# EAGLE schematic damballah_motor (EAGLE 5.10)

## Sheet 1 of 7
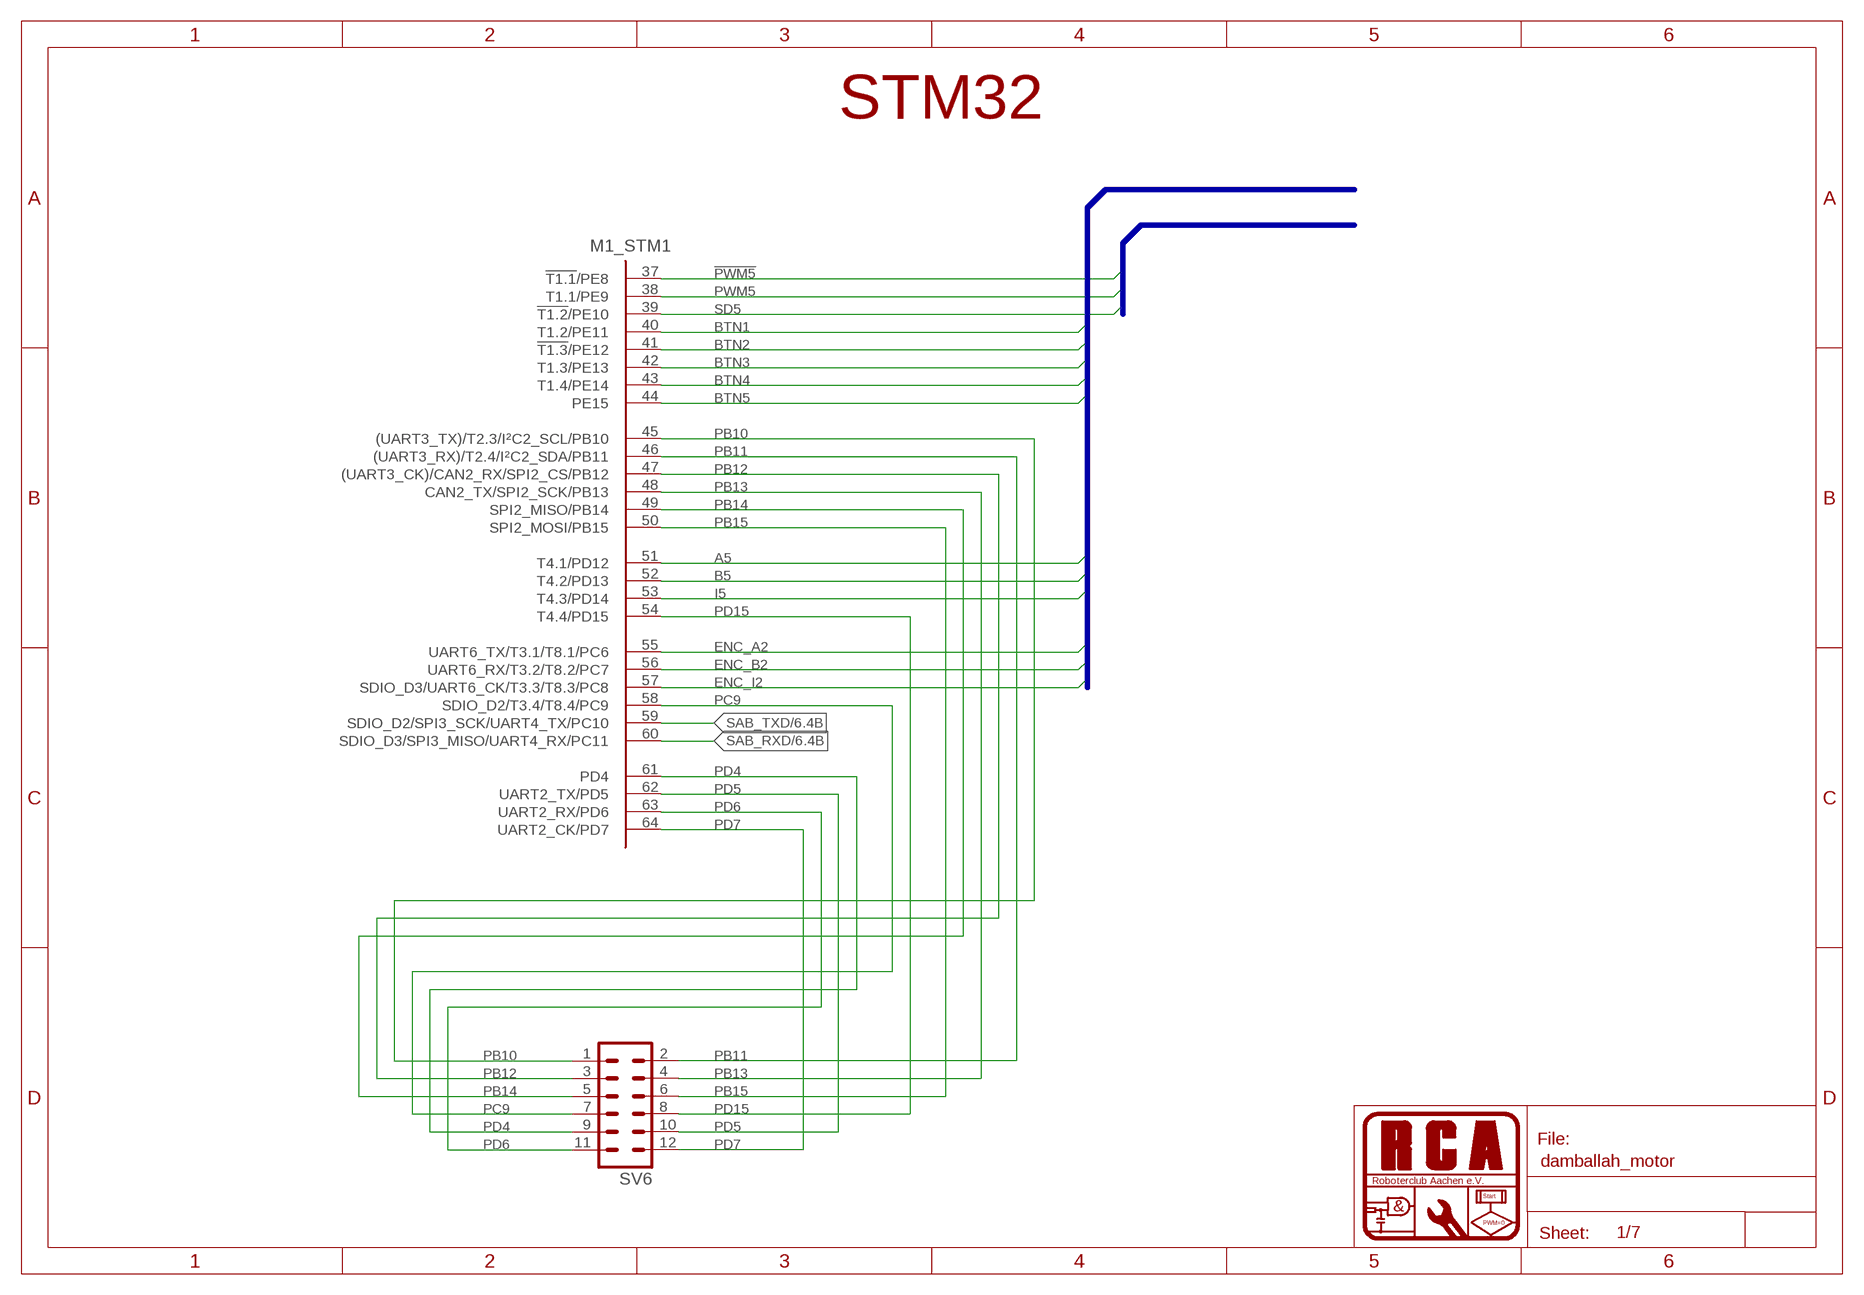
[diagram p0: schematic, sheet 1]

### Parts
M1  DAMBALLAH  [CONTROL]
SV6  MA06-2  [MA06-2]

### Nets
!PWM5: M1.37(_STM1:!T1.1!/PE8) ; also sheet 5
A5: M1.51(_STM1:T4.1/PD12) ; also sheet 5
B5: M1.52(_STM1:T4.2/PD13) ; also sheet 5
BTN1: M1.40(_STM1:T1.2/PE11) ; also sheet 6
BTN2: M1.41(_STM1:!T1.3!/PE12) ; also sheet 6
BTN3: M1.42(_STM1:T1.3/PE13) ; also sheet 6
BTN4: M1.43(_STM1:T1.4/PE14) ; also sheet 6
BTN5: M1.44(_STM1:PE15) ; also sheet 6
ENC_A2: M1.55(_STM1:UART6_TX/T3.1/T8.1/PC6) ; also sheet 6
ENC_B2: M1.56(_STM1:UART6_RX/T3.2/T8.2/PC7) ; also sheet 6
ENC_I2: M1.57(_STM1:SDIO_D3/UART6_CK/T3.3/T8.3/PC8) ; also sheet 6
I5: M1.53(_STM1:T4.3/PD14) ; also sheet 5
PB10: M1.45(_STM1:(UART3_TX)/T2.3/I²C2_SCL/PB10) SV6.1
PB11: M1.46(_STM1:(UART3_RX)/T2.4/I²C2_SDA/PB11) SV6.2
PB12: M1.47(_STM1:(UART3_CK)/CAN2_RX/SPI2_CS/PB12) SV6.3
PB13: M1.48(_STM1:CAN2_TX/SPI2_SCK/PB13) SV6.4
PB14: M1.49(_STM1:SPI2_MISO/PB14) SV6.5
PB15: M1.50(_STM1:SPI2_MOSI/PB15) SV6.6
PC9: M1.58(_STM1:SDIO_D2/T3.4/T8.4/PC9) SV6.7
PD4: M1.61(_STM1:PD4) SV6.9
PD5: M1.62(_STM1:UART2_TX/PD5) SV6.10
PD6: M1.63(_STM1:UART2_RX/PD6) SV6.11
PD7: M1.64(_STM1:UART2_CK/PD7) SV6.12
PD15: M1.54(_STM1:T4.4/PD15) SV6.8
PWM5: M1.38(_STM1:T1.1/PE9) ; also sheet 5
SAB_RXD: M1.60(_STM1:SDIO_D3/SPI3_MISO/UART4_RX/PC11) ; also sheet 6
SAB_TXD: M1.59(_STM1:SDIO_D2/SPI3_SCK/UART4_TX/PC10) ; also sheet 6
SD5: M1.39(_STM1:!T1.2!/PE10) ; also sheet 5

### Buses
AH[1..2],AL[1..2],BH[1..2],BL[1..2],CH[1..2],CL[1..2],SD[3..5],PWM[3..5],!PWM[3..5],SERVO[1..3]
L1_[1..2],L2_[1..2],L3_[1..2],A[1..5],B[1..5],I[1..5],ENC_A[1..2],ENC_B[1..2],ENC_I[1..2],BTN[1..5]

### Notes on the sheet
- STM32

## Sheet 2 of 7
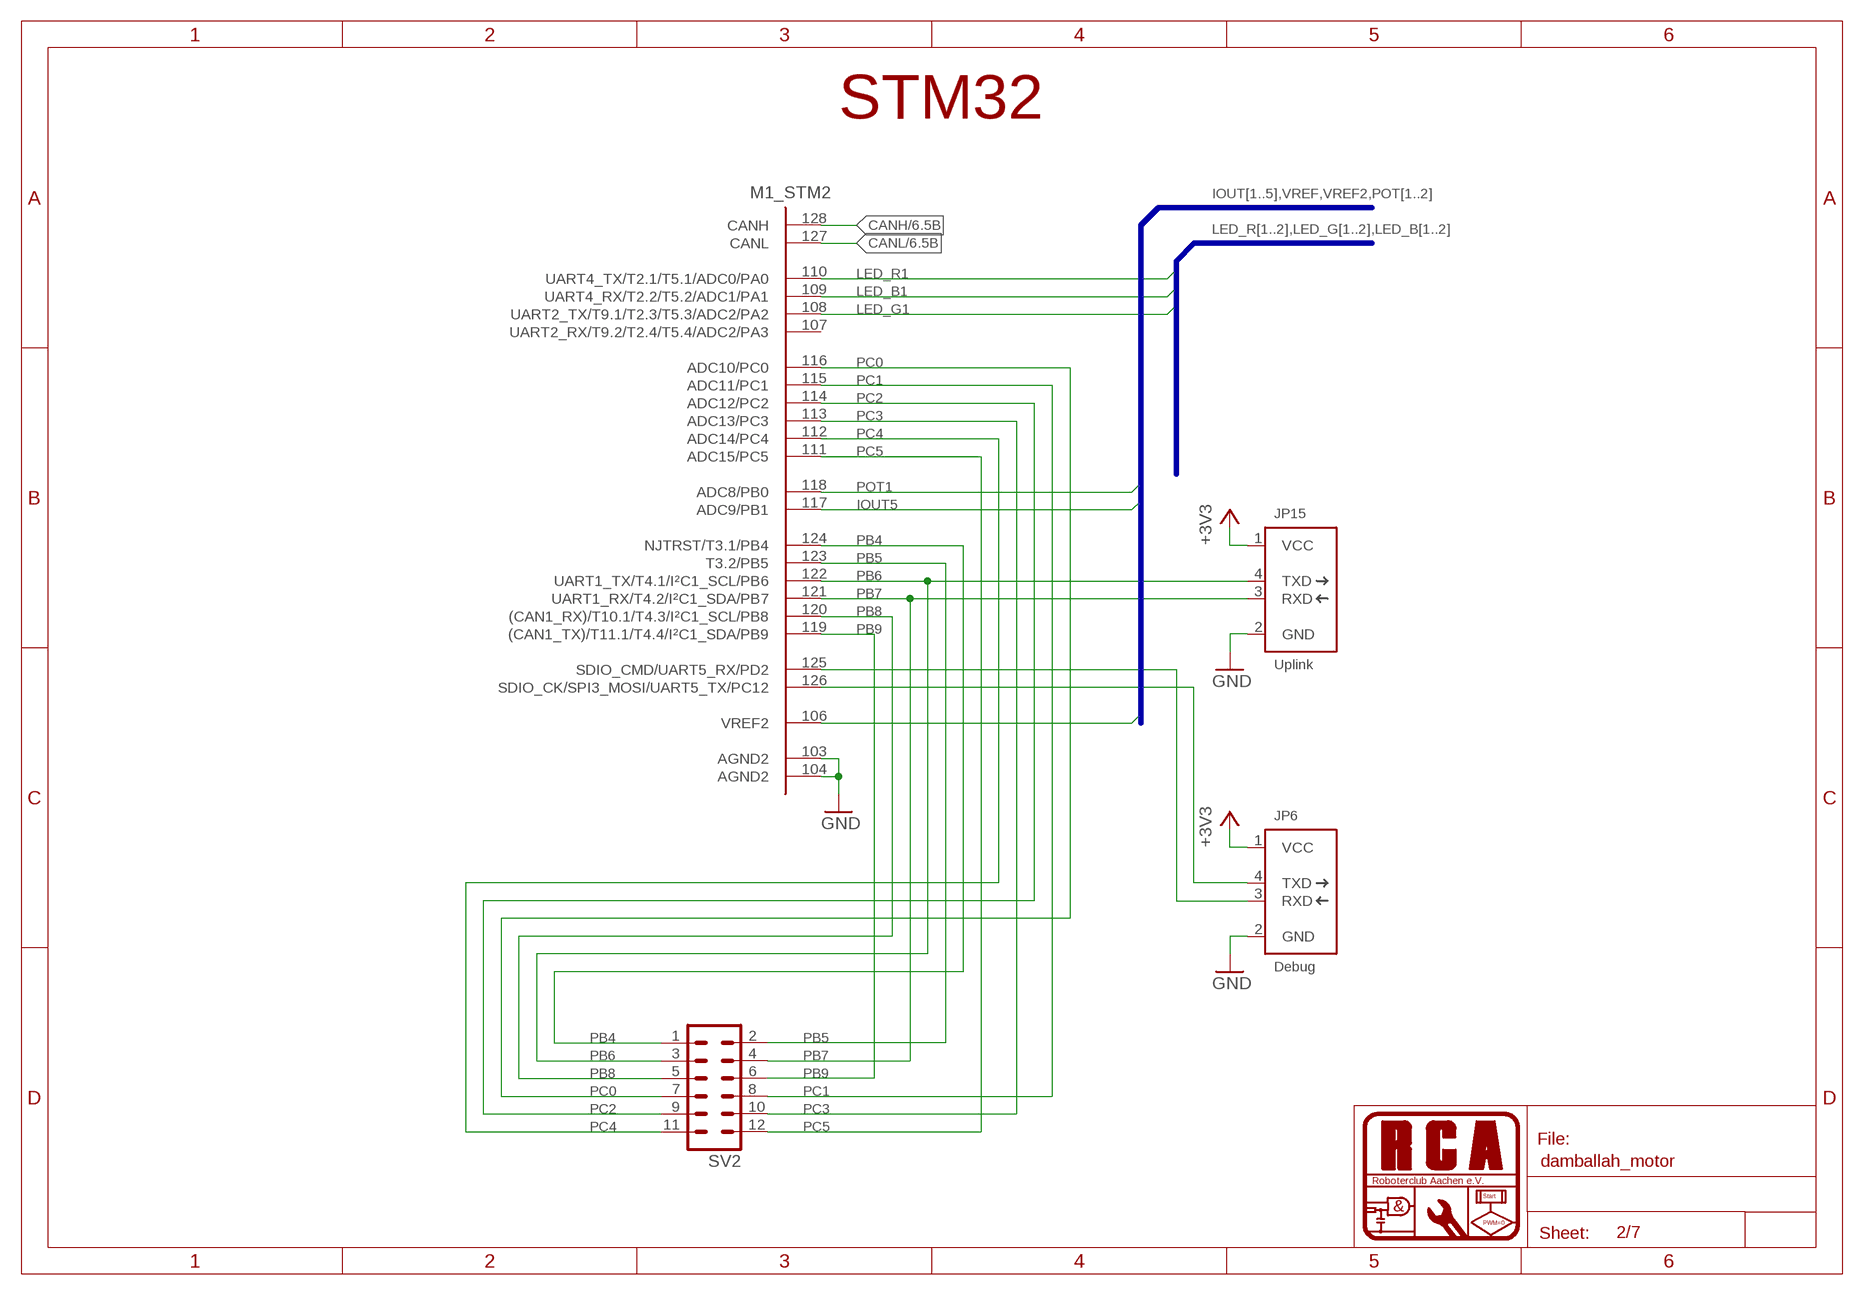
[diagram p1: schematic, sheet 2]

### Parts
JP6  Debug  SERIAL-DEBUGPSS  [22-23-2051]
JP15  Uplink  SERIAL-DEBUGPSS  [22-23-2051]
SV2  MA06-2  [MA06-2]

### Nets
+3V3: JP6.1(VCC) JP15.1(VCC) ; also sheet 3,4,5,6,7
CANH: M1.128(_STM2:CANH) ; also sheet 6
CANL: M1.127(_STM2:CANL) ; also sheet 6
GND: JP6.2(GND) JP15.2(GND) M1.103(_STM2:AGND2) M1.104(_STM2:AGND2) ; also sheet 3,4,5,6,7
IOUT5: M1.117(_STM2:ADC9/PB1) ; also sheet 5
LED_B1: M1.109(_STM2:UART4_RX/T2.2/T5.2/ADC1/PA1) ; also sheet 6
LED_G1: M1.108(_STM2:UART2_TX/T9.1/T2.3/T5.3/ADC2/PA2) ; also sheet 6
LED_R1: M1.110(_STM2:UART4_TX/T2.1/T5.1/ADC0/PA0) ; also sheet 6
PB4: M1.124(_STM2:NJTRST/T3.1/PB4) SV2.1
PB5: M1.123(_STM2:T3.2/PB5) SV2.2
PB6: JP15.4(TXD) M1.122(_STM2:UART1_TX/T4.1/I²C1_SCL/PB6) SV2.3
PB7: JP15.3(RXD) M1.121(_STM2:UART1_RX/T4.2/I²C1_SDA/PB7) SV2.4
PB8: M1.120(_STM2:(CAN1_RX)/T10.1/T4.3/I²C1_SCL/PB8) SV2.5
PB9: M1.119(_STM2:(CAN1_TX)/T11.1/T4.4/I²C1_SDA/PB9) SV2.6
PC0: M1.116(_STM2:ADC10/PC0) SV2.7
PC1: M1.115(_STM2:ADC11/PC1) SV2.8
PC2: M1.114(_STM2:ADC12/PC2) SV2.9
PC3: M1.113(_STM2:ADC13/PC3) SV2.10
PC4: M1.112(_STM2:ADC14/PC4) SV2.11
PC5: M1.111(_STM2:ADC15/PC5) SV2.12
POT1: M1.118(_STM2:ADC8/PB0) ; also sheet 6
UART5_RX: JP6.3(RXD) M1.125(_STM2:SDIO_CMD/UART5_RX/PD2)
UART5_TX: JP6.4(TXD) M1.126(_STM2:SDIO_CK/SPI3_MOSI/UART5_TX/PC12)
VREF2: M1.106(_STM2:VREF2) ; also sheet 3,5
Unconnected: M1.107(_STM2:UART2_RX/T9.2/T2.4/T5.4/ADC2/PA3)

### Buses
IOUT[1..5],VREF,VREF2,POT[1..2]
LED_R[1..2],LED_G[1..2],LED_B[1..2]

### Notes on the sheet
- STM32

## Sheet 3 of 7
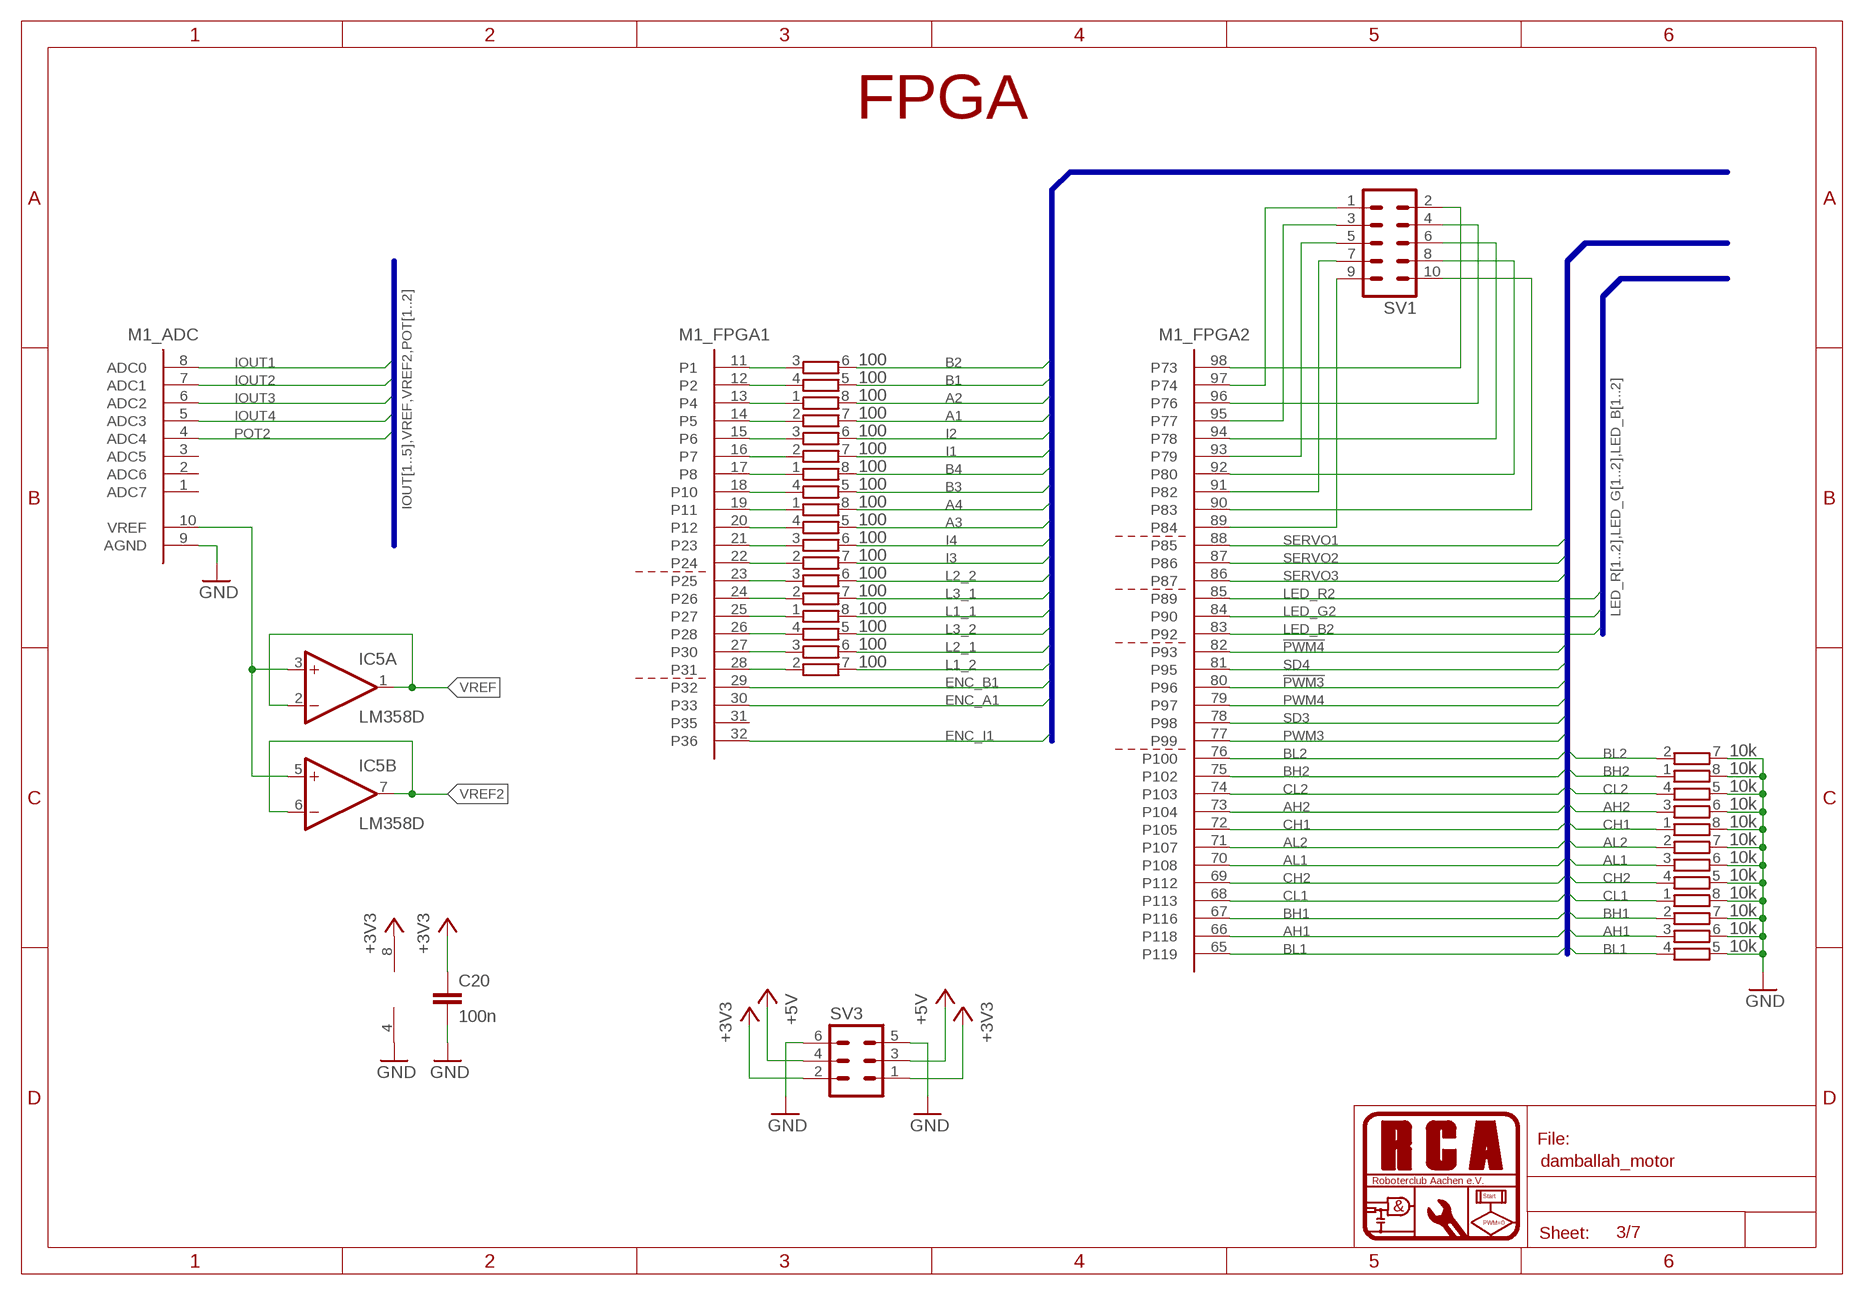
[diagram p2: schematic, sheet 3]

### Parts
C20  100n  C-EUC0805  [C0805]
IC5  LM358D  [SO08]
RN1  100  4R-NEXB38V  [EXB38V]
RN2  100  4R-NEXB38V  [EXB38V]
RN3  100  4R-NEXB38V  [EXB38V]
RN4  100  4R-NEXB38V  [EXB38V]
RN5  100  4R-NEXB38V  [EXB38V]
RN6  10k  4R-NEXB38V  [EXB38V]
RN7  10k  4R-NEXB38V  [EXB38V]
RN8  10k  4R-NEXB38V  [EXB38V]
SV1  MA05-2  [MA05-2]
SV3  MA03-2  [MA03-2]

### Nets
!PWM3: M1.80(_FPGA2:P96) ; also sheet 5
!PWM4: M1.82(_FPGA2:P93) ; also sheet 5
+3V3: C20.1 IC5.8(P:V+) SV3.1 SV3.2 ; also sheet 2,4,5,6,7
+5V: SV3.3 SV3.4 ; also sheet 4,5,6,7
A1: RN1.7 ; also sheet 4
A2: RN2.8 ; also sheet 4
A3: RN5.5 ; also sheet 5
A4: RN3.8 ; also sheet 5
AH1: M1.66(_FPGA2:P118) RN8.3 ; also sheet 4
AH2: M1.73(_FPGA2:P104) RN6.3 ; also sheet 4
AL1: M1.70(_FPGA2:P108) RN7.3 ; also sheet 4
AL2: M1.71(_FPGA2:P107) RN7.2 ; also sheet 4
B1: RN1.5 ; also sheet 4
B2: RN1.6 ; also sheet 4
B3: RN2.5 ; also sheet 5
B4: RN1.8 ; also sheet 5
BH1: M1.67(_FPGA2:P116) RN8.2 ; also sheet 4
BH2: M1.75(_FPGA2:P102) RN6.1 ; also sheet 4
BL1: M1.65(_FPGA2:P119) RN8.4 ; also sheet 4
BL2: M1.76(_FPGA2:P100) RN6.2 ; also sheet 4
CH1: M1.72(_FPGA2:P105) RN7.1 ; also sheet 4
CH2: M1.69(_FPGA2:P112) RN7.4 ; also sheet 4
CL1: M1.68(_FPGA2:P113) RN8.1 ; also sheet 4
CL2: M1.74(_FPGA2:P103) RN6.4 ; also sheet 4
ENC_A1: M1.30(_FPGA1:P33) ; also sheet 6
ENC_B1: M1.29(_FPGA1:P32) ; also sheet 6
ENC_I1: M1.32(_FPGA1:P36) ; also sheet 6
GND: C20.2 IC5.4(P:V-) M1.9(_ADC:AGND) RN6.5 RN6.6 RN6.7 RN6.8 RN7.5 RN7.6 RN7.7 RN7.8 RN8.5 RN8.6 RN8.7 RN8.8 SV3.5 SV3.6 ; also sheet 2,4,5,6,7
I1: RN2.7 ; also sheet 4
I2: RN2.6 ; also sheet 4
I3: RN3.7 ; also sheet 5
I4: RN3.6 ; also sheet 5
IOUT1: M1.8(_ADC:ADC0) ; also sheet 4
IOUT2: M1.7(_ADC:ADC1) ; also sheet 4
IOUT3: M1.6(_ADC:ADC2) ; also sheet 5
IOUT4: M1.5(_ADC:ADC3) ; also sheet 5
L1_1: RN5.8 ; also sheet 4
L1_2: RN4.7 ; also sheet 4
L2_1: RN4.6 ; also sheet 4
L2_2: RN5.6 ; also sheet 4
L3_1: RN5.7 ; also sheet 4
L3_2: RN4.5 ; also sheet 4
LED_B2: M1.83(_FPGA2:P92) ; also sheet 6
LED_G2: M1.84(_FPGA2:P90) ; also sheet 6
LED_R2: M1.85(_FPGA2:P89) ; also sheet 6
N$29: M1.16(_FPGA1:P7) RN2.2
N$39: M1.15(_FPGA1:P6) RN2.3
N$42: M1.13(_FPGA1:P4) RN2.1
N$45: M1.18(_FPGA1:P10) RN2.4
N$46: M1.21(_FPGA1:P23) RN3.3
N$70: M1.22(_FPGA1:P24) RN3.2
N$92: M1.19(_FPGA1:P11) RN3.1
N$93: IC5.3(A:+IN) IC5.5(B:+IN) M1.10(_ADC:VREF)
N$94: M1.12(_FPGA1:P2) RN1.4
N$95: M1.11(_FPGA1:P1) RN1.3
N$96: M1.14(_FPGA1:P5) RN1.2
N$97: M1.17(_FPGA1:P8) RN1.1
N$98: M1.20(_FPGA1:P12) RN5.4
N$99: M1.23(_FPGA1:P25) RN5.3
N$100: M1.24(_FPGA1:P26) RN5.2
N$101: M1.25(_FPGA1:P27) RN5.1
N$102: M1.27(_FPGA1:P30) RN4.3
N$103: M1.26(_FPGA1:P28) RN4.4
N$104: M1.28(_FPGA1:P31) RN4.2
N$105: M1.98(_FPGA2:P73) SV1.2
N$106: M1.97(_FPGA2:P74) SV1.1
N$107: M1.96(_FPGA2:P76) SV1.4
N$108: M1.95(_FPGA2:P77) SV1.3
N$109: M1.94(_FPGA2:P78) SV1.6
N$110: M1.93(_FPGA2:P79) SV1.5
N$111: M1.92(_FPGA2:P80) SV1.8
N$112: M1.91(_FPGA2:P82) SV1.7
N$113: M1.90(_FPGA2:P83) SV1.10
N$114: M1.89(_FPGA2:P84) SV1.9
POT2: M1.4(_ADC:ADC4) ; also sheet 6
PWM3: M1.77(_FPGA2:P99) ; also sheet 5
PWM4: M1.79(_FPGA2:P97) ; also sheet 5
SD3: M1.78(_FPGA2:P98) ; also sheet 4
SD4: M1.81(_FPGA2:P95) ; also sheet 5
SERVO1: M1.88(_FPGA2:P85) ; also sheet 4
SERVO2: M1.87(_FPGA2:P86) ; also sheet 4
SERVO3: M1.86(_FPGA2:P87) ; also sheet 4
VREF: IC5.1(A:OUT) IC5.2(A:-IN) ; also sheet 6
VREF2: IC5.6(B:-IN) IC5.7(B:OUT) ; also sheet 2,5
Unconnected: M1.1(_ADC:ADC7) M1.2(_ADC:ADC6) M1.3(_ADC:ADC5) M1.31(_FPGA1:P35) RN3.4 RN3.5 RN4.1 RN4.8

### Buses
AH[1..2],AL[1..2],BH[1..2],BL[1..2],CH[1..2],CL[1..2],SD[3..5],PWM[3..5],!PWM[3..5],SERVO[1..3]
L1_[1..2],L2_[1..2],L3_[1..2],A[1..5],B[1..5],I[1..5],ENC_A[1..2],ENC_B[1..2],ENC_I[1..2],BTN[1..5]
LED_R[1..2],LED_G[1..2],LED_B[1..2]
IOUT[1..5],VREF,VREF2,POT[1..2]

### Notes on the sheet
- FPGA

## Sheet 4 of 7
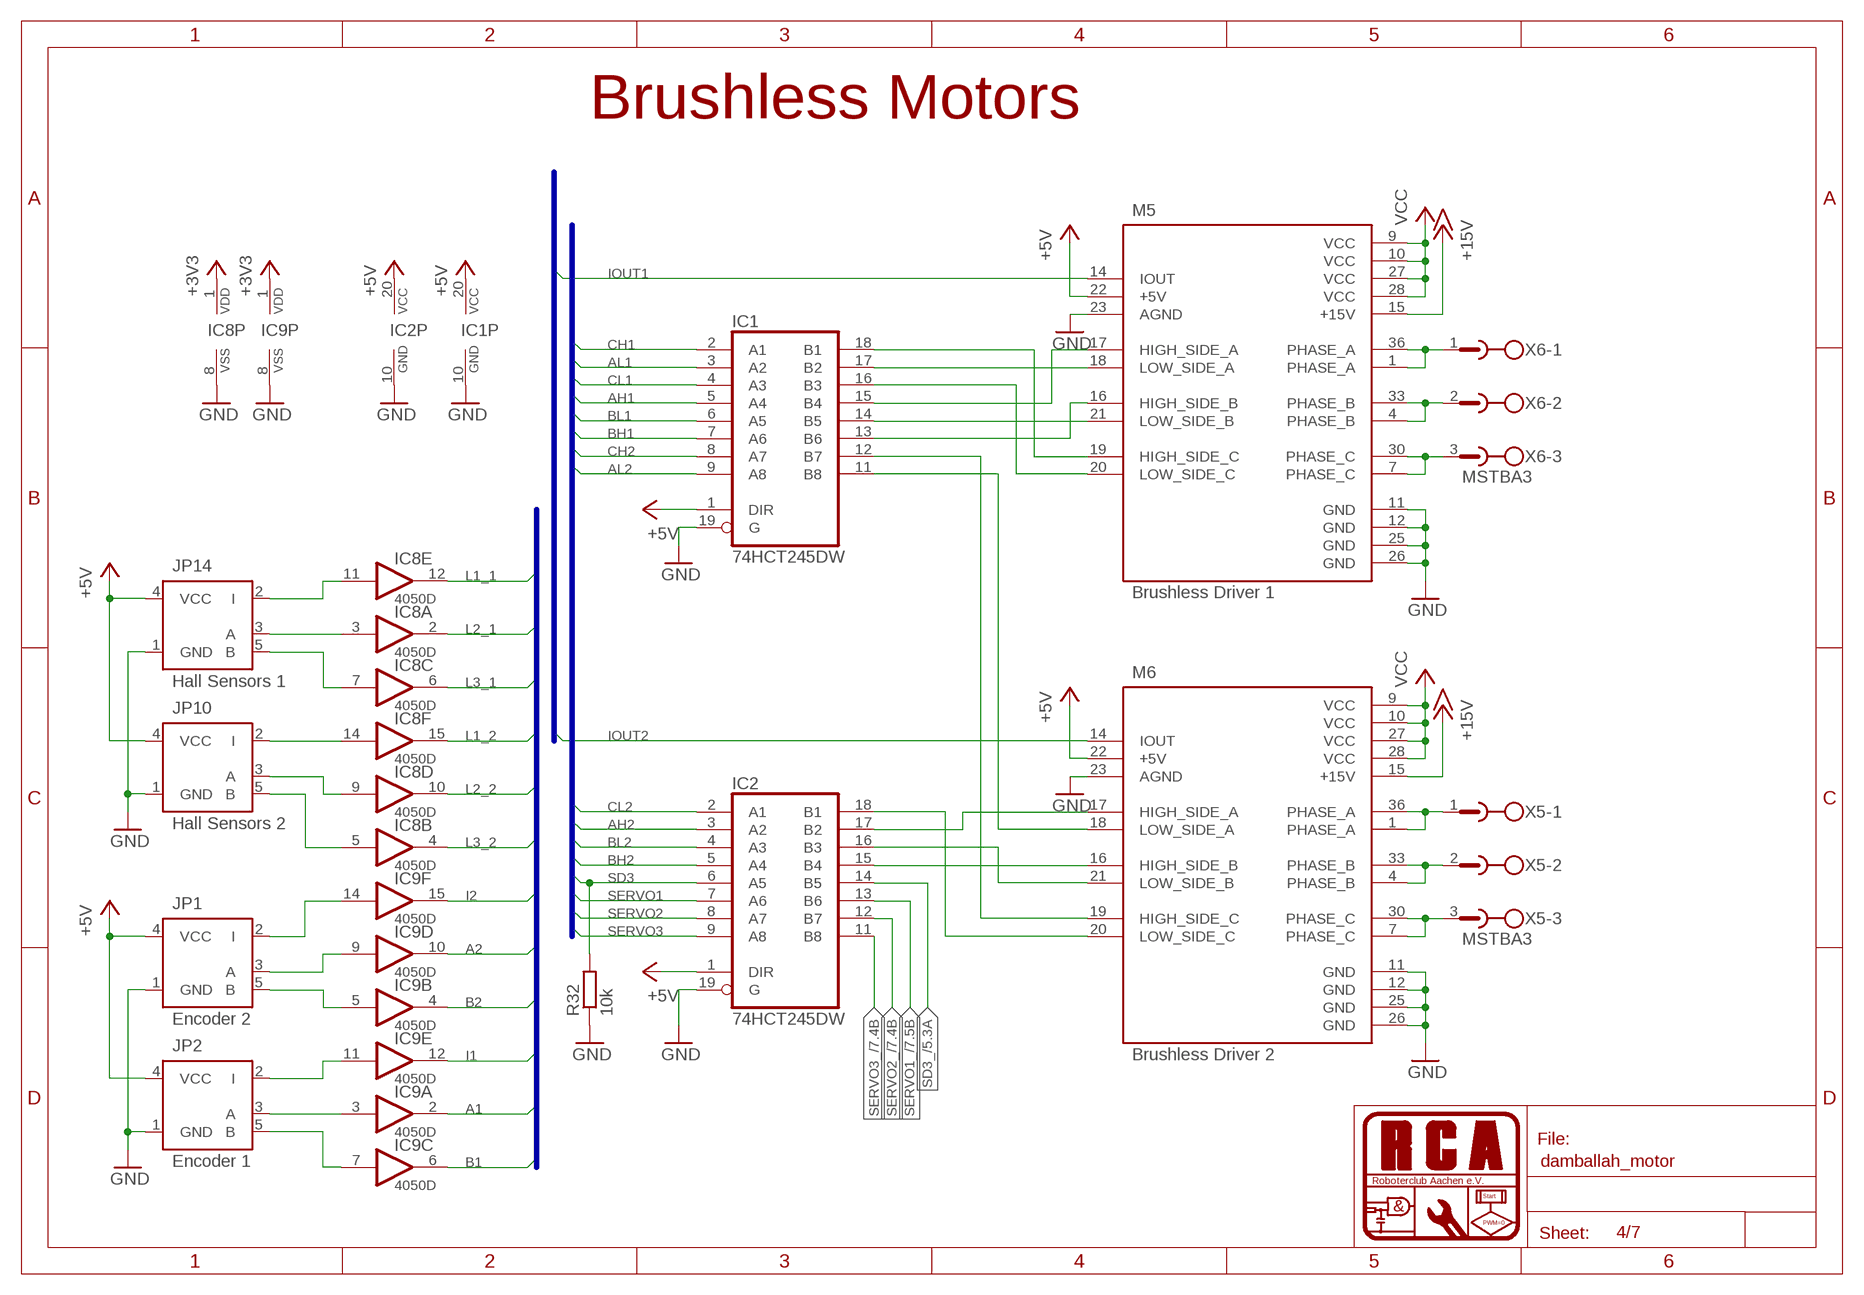
[diagram p3: schematic, sheet 4]

### Parts
IC1  74HCT245DW  [SO20W]
IC2  74HCT245DW  [SO20W]
IC8  4050D  [SO16]
IC9  4050D  [SO16]
JP1  Encoder 2  ENCODERPSS  [22-23-2051]
JP2  Encoder 1  ENCODERPSS  [22-23-2051]
JP10  Hall Sensors 2  ENCODERPSS  [22-23-2051]
JP14  Hall Sensors 1  ENCODERPSS  [22-23-2051]
M5  Brushless Driver 1  BRUSHLESS_DRIVER  [BRUSHLESS_DRIVER]
M6  Brushless Driver 2  BRUSHLESS_DRIVER  [BRUSHLESS_DRIVER]
R32  10k  R-EU_M0805  [M0805]
X5  MSTBA3  [MSTBA3]
X6  MSTBA3  [MSTBA3]

### Nets
+3V3: IC8.1(P:VDD) IC9.1(P:VDD) ; also sheet 2,3,5,6,7
+5V: IC1.1(DIR) IC1.20(VCC) IC2.1(DIR) IC2.20(VCC) JP1.4(VCC) JP2.4(VCC) JP10.4(VCC) JP14.4(VCC) M5.22(+5V) M6.22(+5V) ; also sheet 3,5,6,7
+15V: M5.15(+15V) M6.15(+15V) ; also sheet 5,6,7
A1: IC9.2(A:O) ; also sheet 3
A2: IC9.10(D:O) ; also sheet 3
AH1: IC1.5(A4) ; also sheet 3
AH2: IC2.3(A2) ; also sheet 3
AL1: IC1.3(A2) ; also sheet 3
AL2: IC1.9(A8) ; also sheet 3
B1: IC9.6(C:O) ; also sheet 3
B2: IC9.4(B:O) ; also sheet 3
BH1: IC1.7(A6) ; also sheet 3
BH2: IC2.5(A4) ; also sheet 3
BL1: IC1.6(A5) ; also sheet 3
BL2: IC2.4(A3) ; also sheet 3
CH1: IC1.2(A1) ; also sheet 3
CH2: IC1.8(A7) ; also sheet 3
CL1: IC1.4(A3) ; also sheet 3
CL2: IC2.2(A1) ; also sheet 3
GND: IC1.10(GND) IC1.19(G) IC2.10(GND) IC2.19(G) IC8.8(P:VSS) IC9.8(P:VSS) JP1.1(GND) JP2.1(GND) JP10.1(GND) JP14.1(GND) M5.11(GND) M5.12(GND) M5.23(AGND) M5.25(GND) M5.26(GND) M6.11(GND) M6.12(GND) M6.23(AGND) M6.25(GND) M6.26(GND) R32.1 ; also sheet 2,3,5,6,7
I1: IC9.12(E:O) ; also sheet 3
I2: IC9.15(F:O) ; also sheet 3
IOUT1: M5.14(IOUT) ; also sheet 3
IOUT2: M6.14(IOUT) ; also sheet 3
L1_1: IC8.12(E:O) ; also sheet 3
L1_2: IC8.15(F:O) ; also sheet 3
L2_1: IC8.2(A:O) ; also sheet 3
L2_2: IC8.10(D:O) ; also sheet 3
L3_1: IC8.6(C:O) ; also sheet 3
L3_2: IC8.4(B:O) ; also sheet 3
N$3: M5.1(PHASE_A) M5.36(PHASE_A) X6.1
N$4: M5.4(PHASE_B) M5.33(PHASE_B) X6.2
N$7: M5.7(PHASE_C) M5.30(PHASE_C) X6.3
N$9: M6.7(PHASE_C) M6.30(PHASE_C) X5.3
N$11: M6.4(PHASE_B) M6.33(PHASE_B) X5.2
N$12: M6.1(PHASE_A) M6.36(PHASE_A) X5.1
N$55: IC1.18(B1) M5.19(HIGH_SIDE_C)
N$59: IC1.17(B2) M5.18(LOW_SIDE_A)
N$60: IC1.16(B3) M5.20(LOW_SIDE_C)
N$61: IC1.15(B4) M5.17(HIGH_SIDE_A)
N$62: IC1.13(B6) M5.16(HIGH_SIDE_B)
N$63: IC1.14(B5) M5.21(LOW_SIDE_B)
N$64: IC2.18(B1) M6.20(LOW_SIDE_C)
N$65: IC1.11(B8) M6.18(LOW_SIDE_A)
N$66: IC2.16(B3) M6.21(LOW_SIDE_B)
N$67: IC2.15(B4) M6.16(HIGH_SIDE_B)
N$68: IC2.17(B2) M6.17(HIGH_SIDE_A)
N$69: IC1.12(B7) M6.19(HIGH_SIDE_C)
N$71: IC8.11(E:I) JP14.2(I)
N$72: IC8.3(A:I) JP14.3(A)
N$73: IC8.7(C:I) JP14.5(B)
N$74: IC8.14(F:I) JP10.2(I)
N$75: IC8.9(D:I) JP10.3(A)
N$76: IC8.5(B:I) JP10.5(B)
N$77: IC9.14(F:I) JP1.2(I)
N$78: IC9.9(D:I) JP1.3(A)
N$79: IC9.5(B:I) JP1.5(B)
N$80: IC9.11(E:I) JP2.2(I)
N$81: IC9.3(A:I) JP2.3(A)
N$82: IC9.7(C:I) JP2.5(B)
SD3: IC2.6(A5) R32.2 ; also sheet 3
SD3_: IC2.14(B5) ; also sheet 5
SERVO1: IC2.7(A6) ; also sheet 3
SERVO1_: IC2.13(B6) ; also sheet 7
SERVO2: IC2.8(A7) ; also sheet 3
SERVO2_: IC2.12(B7) ; also sheet 7
SERVO3: IC2.9(A8) ; also sheet 3
SERVO3_: IC2.11(B8) ; also sheet 7
VCC: M5.9(VCC) M5.10(VCC) M5.27(VCC) M5.28(VCC) M6.9(VCC) M6.10(VCC) M6.27(VCC) M6.28(VCC) ; also sheet 5,7

### Buses
L1_[1..2],L2_[1..2],L3_[1..2],A[1..5],B[1..5],I[1..5],ENC_A[1..2],ENC_B[1..2],ENC_I[1..2],BTN[1..5]
AH[1..2],AL[1..2],BH[1..2],BL[1..2],CH[1..2],CL[1..2],SD[3..5],PWM[3..5],!PWM[3..5],SERVO[1..3]
IOUT[1..5],VREF,VREF2,POT[1..2]

### Notes on the sheet
- Brushless Motors

## Sheet 5 of 7
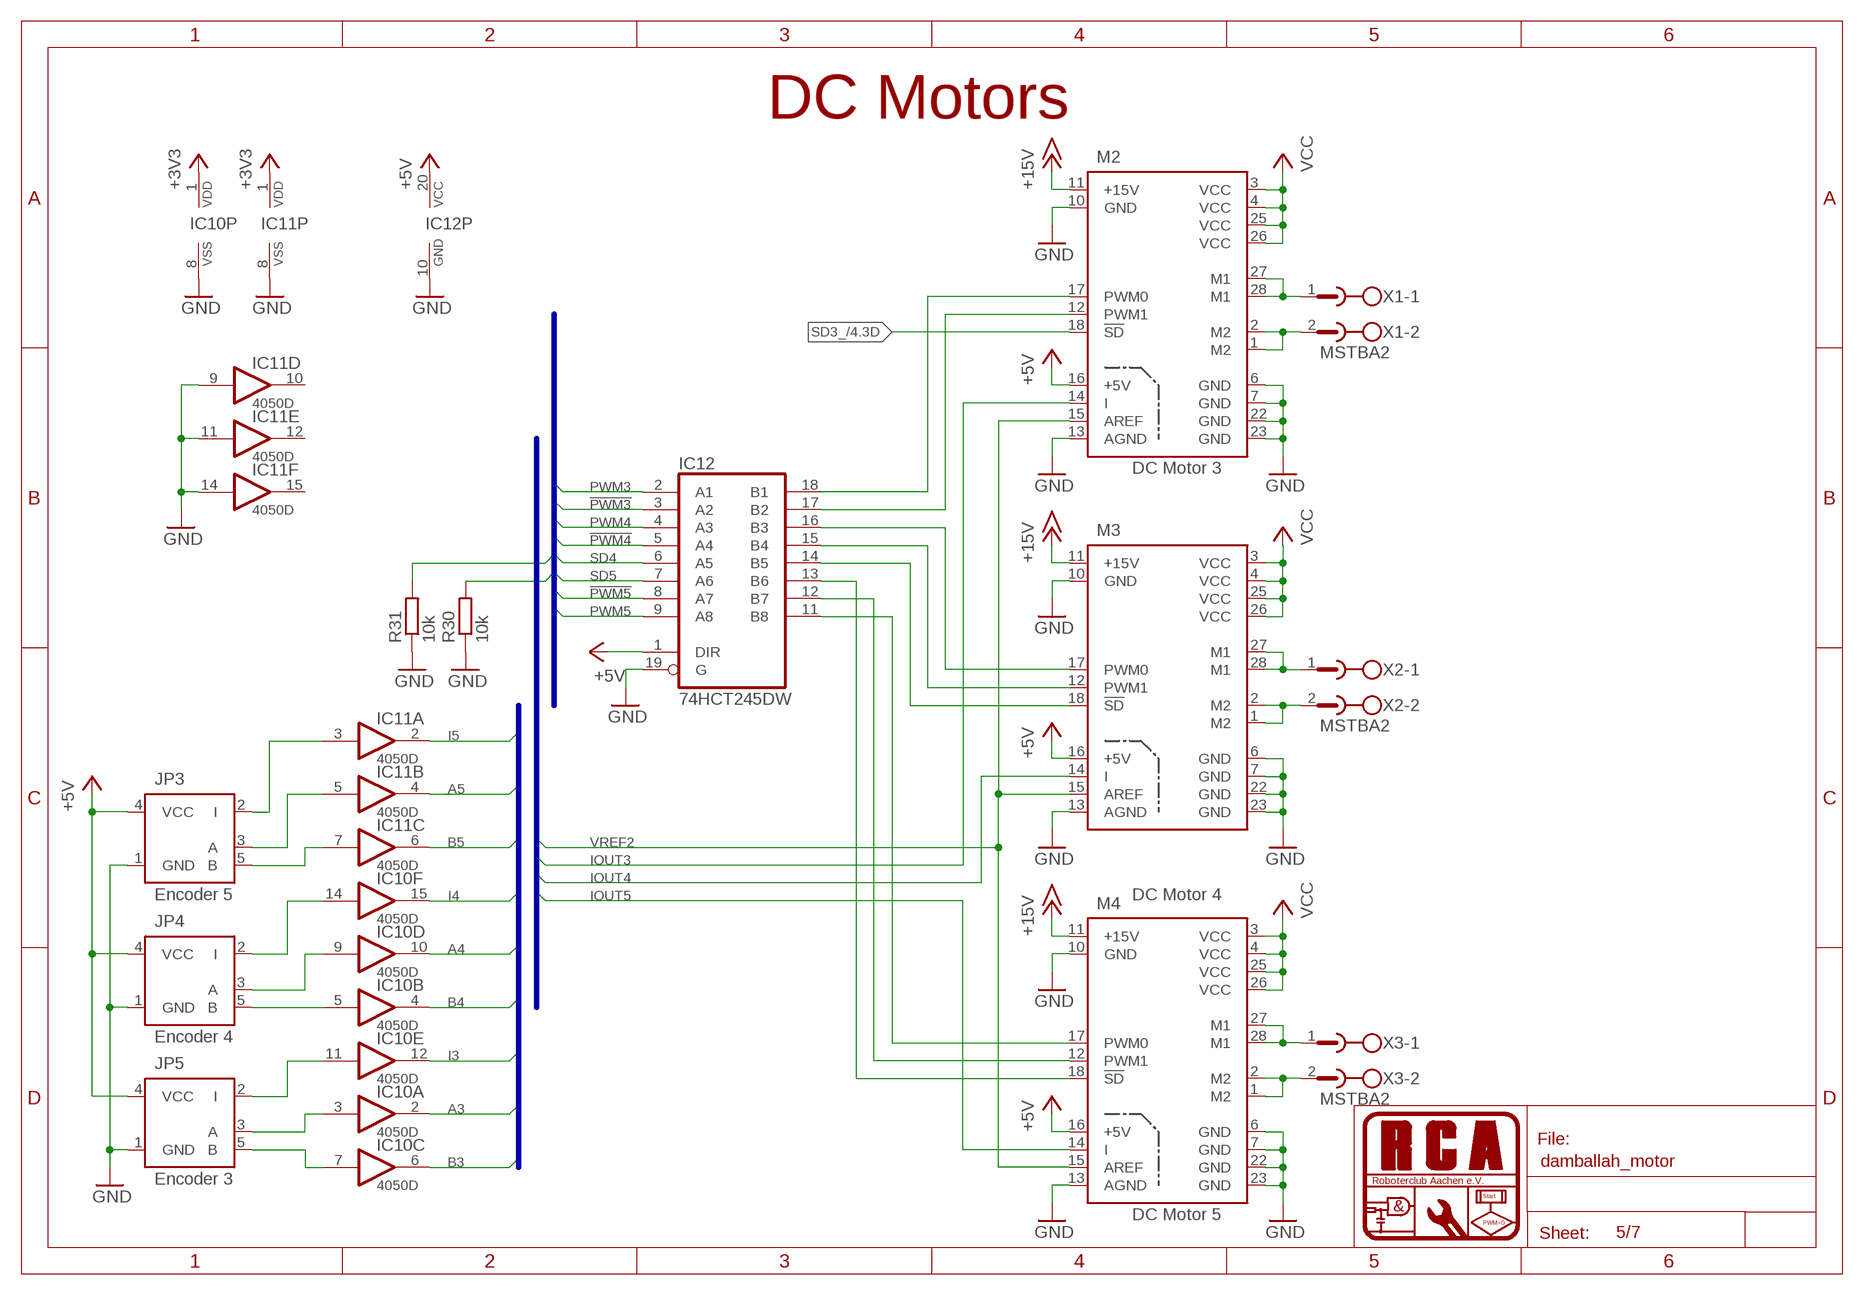
[diagram p4: schematic, sheet 5]

### Parts
IC10  4050D  [SO16]
IC11  4050D  [SO16]
IC12  74HCT245DW  [SO20W]
JP3  Encoder 5  ENCODERPSS  [22-23-2051]
JP4  Encoder 4  ENCODERPSS  [22-23-2051]
JP5  Encoder 3  ENCODERPSS  [22-23-2051]
M2  DC Motor 3  H-BRIDGE2  [IRF7413_SIDEWARDS]
M3  DC Motor 4  H-BRIDGE2  [IRF7413_SIDEWARDS]
M4  DC Motor 5  H-BRIDGE2  [IRF7413_SIDEWARDS]
R30  10k  R-EU_M0805  [M0805]
R31  10k  R-EU_M0805  [M0805]
X1  MSTBA2  [MSTBA2]
X2  MSTBA2  [MSTBA2]
X3  MSTBA2  [MSTBA2]

### Nets
!PWM3: IC12.3(A2) ; also sheet 3
!PWM4: IC12.5(A4) ; also sheet 3
!PWM5: IC12.8(A7) ; also sheet 1
+3V3: IC10.1(P:VDD) IC11.1(P:VDD) ; also sheet 2,3,4,6,7
+5V: IC12.1(DIR) IC12.20(VCC) JP3.4(VCC) JP4.4(VCC) JP5.4(VCC) M2.16(+5V) M3.16(+5V) M4.16(+5V) ; also sheet 3,4,6,7
+15V: M2.11(+15V) M3.11(+15V) M4.11(+15V) ; also sheet 4,6,7
A3: IC10.2(A:O) ; also sheet 3
A4: IC10.10(D:O) ; also sheet 3
A5: IC11.4(B:O) ; also sheet 1
B3: IC10.6(C:O) ; also sheet 3
B4: IC10.4(B:O) ; also sheet 3
B5: IC11.6(C:O) ; also sheet 1
GND: IC10.8(P:VSS) IC11.8(P:VSS) IC11.9(D:I) IC11.11(E:I) IC11.14(F:I) IC12.10(GND) IC12.19(G) JP3.1(GND) JP4.1(GND) JP5.1(GND) M2.6(GND) M2.7(GND) M2.10(GND) M2.13(AGND) M2.22(GND) M2.23(GND) M3.6(GND) M3.7(GND) M3.10(GND) M3.13(AGND) M3.22(GND) M3.23(GND) M4.6(GND) M4.7(GND) M4.10(GND) M4.13(AGND) M4.22(GND) M4.23(GND) R30.1 R31.1 ; also sheet 2,3,4,6,7
I3: IC10.12(E:O) ; also sheet 3
I4: IC10.15(F:O) ; also sheet 3
I5: IC11.2(A:O) ; also sheet 1
IOUT3: M2.14(I) ; also sheet 3
IOUT4: M3.14(I) ; also sheet 3
IOUT5: M4.14(I) ; also sheet 2
N$1: M2.27(M1) M2.28(M1) X1.1
N$2: M2.1(M2) M2.2(M2) X1.2
N$5: M3.27(M1) M3.28(M1) X2.1
N$6: M3.1(M2) M3.2(M2) X2.2
N$8: M4.27(M1) M4.28(M1) X3.1
N$10: M4.1(M2) M4.2(M2) X3.2
N$50: IC12.14(B5) M3.18(!SD)
N$51: IC12.15(B4) M3.12(PWM1)
N$52: IC12.16(B3) M3.17(PWM0)
N$53: IC12.17(B2) M2.12(PWM1)
N$54: IC12.18(B1) M2.17(PWM0)
N$56: IC12.13(B6) M4.18(!SD)
N$57: IC12.12(B7) M4.12(PWM1)
N$58: IC12.11(B8) M4.17(PWM0)
N$83: IC10.7(C:I) JP5.5(B)
N$84: IC10.3(A:I) JP5.3(A)
N$85: IC10.11(E:I) JP5.2(I)
N$86: IC10.5(B:I) JP4.5(B)
N$87: IC10.9(D:I) JP4.3(A)
N$88: IC10.14(F:I) JP4.2(I)
N$89: IC11.7(C:I) JP3.5(B)
N$90: IC11.5(B:I) JP3.3(A)
N$91: IC11.3(A:I) JP3.2(I)
PWM3: IC12.2(A1) ; also sheet 3
PWM4: IC12.4(A3) ; also sheet 3
PWM5: IC12.9(A8) ; also sheet 1
SD3_: M2.18(!SD) ; also sheet 4
SD4: IC12.6(A5) R31.2 ; also sheet 3
SD5: IC12.7(A6) R30.2 ; also sheet 1
VCC: M2.3(VCC) M2.4(VCC) M2.25(VCC) M2.26(VCC) M3.3(VCC) M3.4(VCC) M3.25(VCC) M3.26(VCC) M4.3(VCC) M4.4(VCC) M4.25(VCC) M4.26(VCC) ; also sheet 4,7
VREF2: M2.15(AREF) M3.15(AREF) M4.15(AREF) ; also sheet 2,3
Unconnected: IC11.10(D:O) IC11.12(E:O) IC11.15(F:O)

### Buses
L1_[1..2],L2_[1..2],L3_[1..2],A[1..5],B[1..5],I[1..5],ENC_A[1..2],ENC_B[1..2],ENC_I[1..2],BTN[1..5]
AH[1..2],AL[1..2],BH[1..2],BL[1..2],CH[1..2],CL[1..2],SD[3..5],PWM[3..5],!PWM[3..5],SERVO[1..3]
IOUT[1..5],VREF,VREF2,POT[1..2]

### Notes on the sheet
- DC Motors

## Sheet 6 of 7
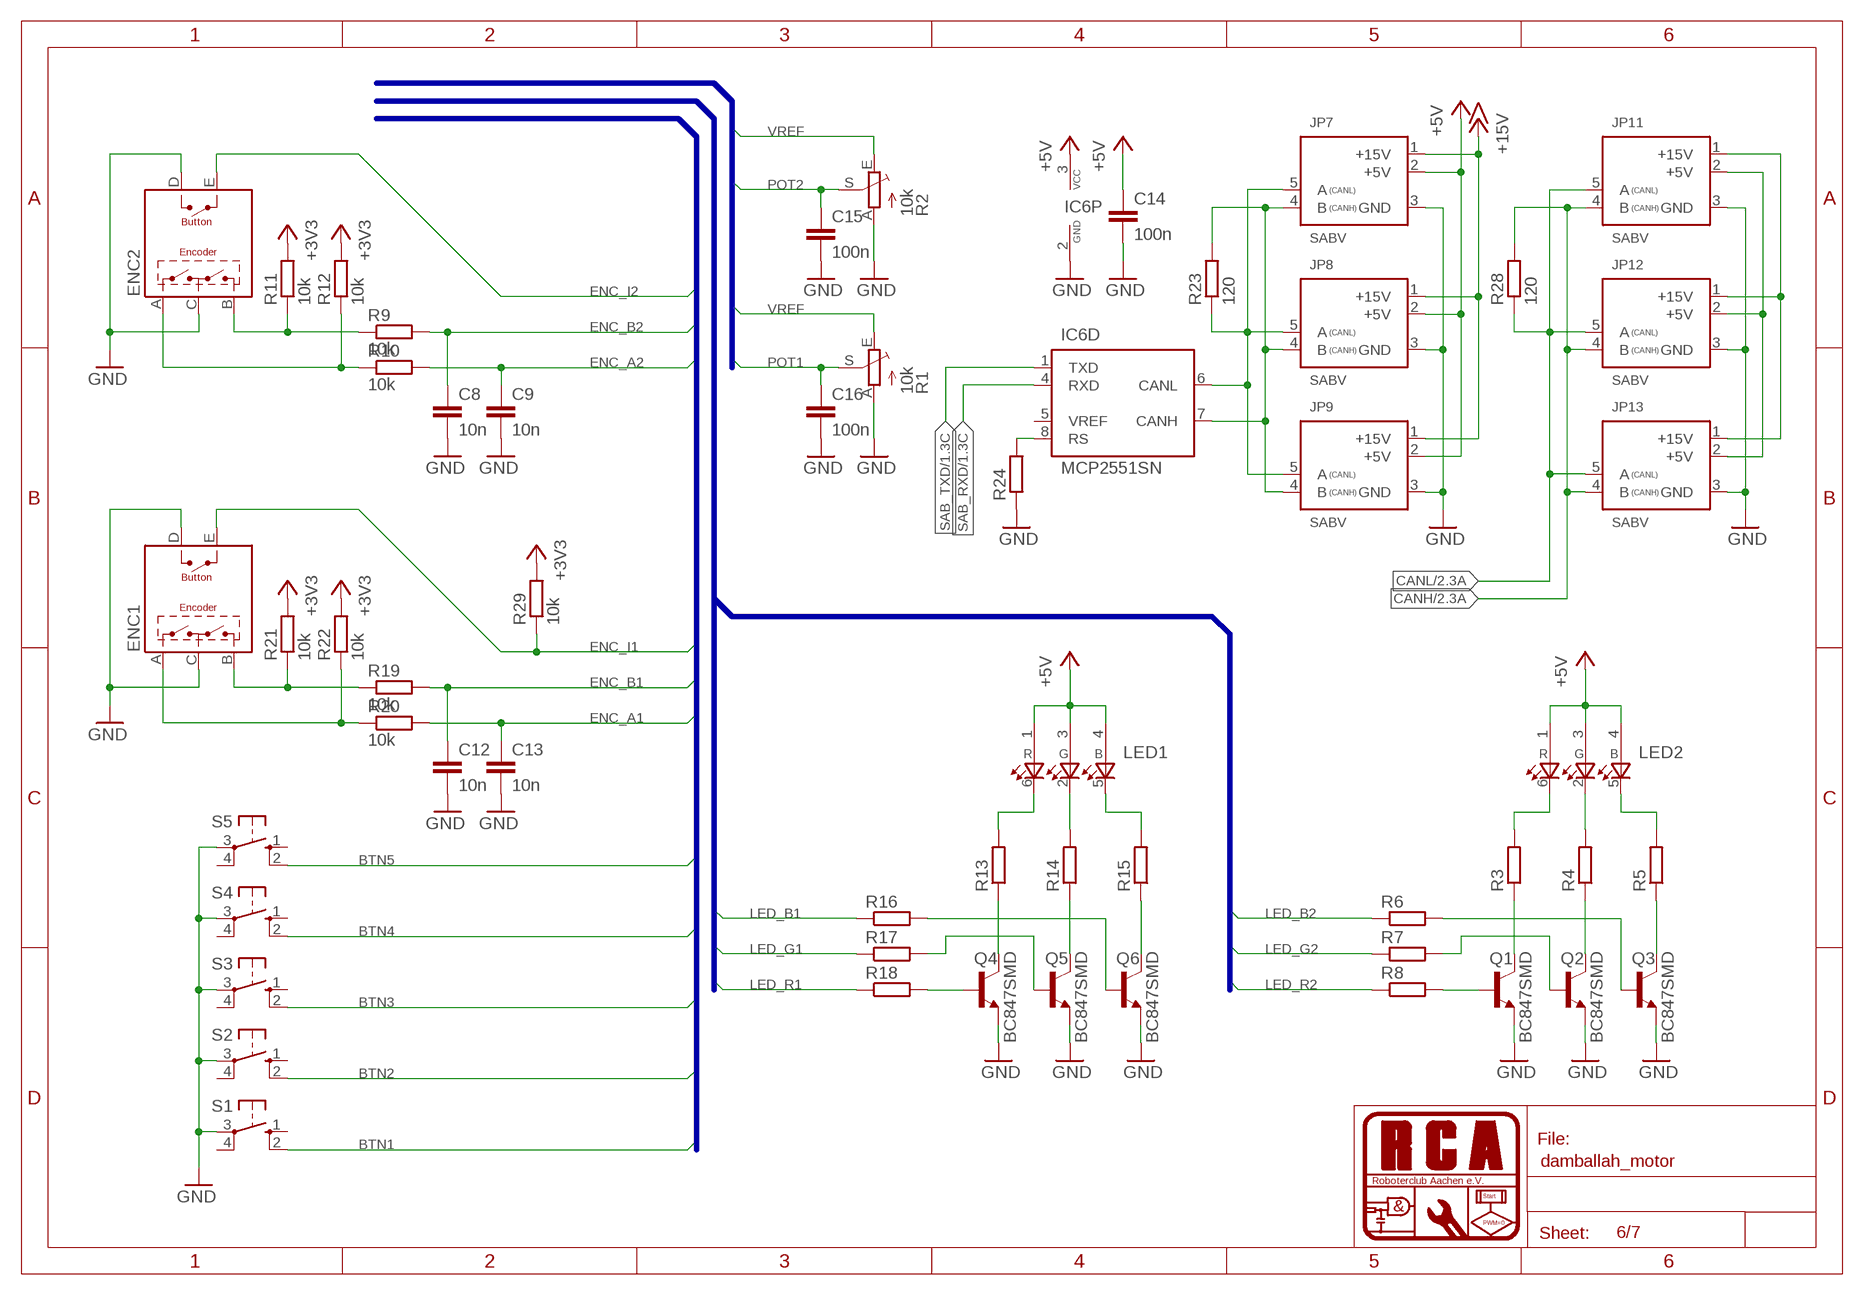
[diagram p5: schematic, sheet 6]

### Parts
C8  10n  C-EUC0805  [C0805]
C9  10n  C-EUC0805  [C0805]
C12  10n  C-EUC0805  [C0805]
C13  10n  C-EUC0805  [C0805]
C14  100n  C-EUC0805  [C0805]
C15  100n  C-EUC0805  [C0805]
C16  100n  C-EUC0805  [C0805]
ENC1  ENCODER  [EC12E24244]
ENC2  ENCODER  [EC12E24244]
IC6  MCP2551SN  [SOIC-8]
JP7  SABV  [22-23-2051]
JP8  SABV  [22-23-2051]
JP9  SABV  [22-23-2051]
JP11  SABV  [22-23-2051]
JP12  SABV  [22-23-2051]
JP13  SABV  [22-23-2051]
LED1  RGB-LED-6  [P-LCC-6]
LED2  RGB-LED-6  [P-LCC-6]
Q1  BC847SMD  [SOT23]
Q2  BC847SMD  [SOT23]
Q3  BC847SMD  [SOT23]
Q4  BC847SMD  [SOT23]
Q5  BC847SMD  [SOT23]
Q6  BC847SMD  [SOT23]
R1  10k  TRIM_EU-LI10  [LI10]
R2  10k  TRIM_EU-LI10  [LI10]
R3  R-EU_M0805  [M0805]
R4  R-EU_M0805  [M0805]
R5  R-EU_M0805  [M0805]
R6  R-EU_M0805  [M0805]
R7  R-EU_M0805  [M0805]
R8  R-EU_M0805  [M0805]
R9  10k  R-EU_M0805  [M0805]
R10  10k  R-EU_M0805  [M0805]
R11  10k  R-EU_M0805  [M0805]
R12  10k  R-EU_M0805  [M0805]
R13  R-EU_M0805  [M0805]
R14  R-EU_M0805  [M0805]
R15  R-EU_M0805  [M0805]
R16  R-EU_M0805  [M0805]
R17  R-EU_M0805  [M0805]
R18  R-EU_M0805  [M0805]
R19  10k  R-EU_M0805  [M0805]
R20  10k  R-EU_M0805  [M0805]
R21  10k  R-EU_M0805  [M0805]
R22  10k  R-EU_M0805  [M0805]
R23  120  R-EU_M0805  [M0805]
R24  R-EU_M0805  [M0805]
R28  120  R-EU_M0805  [M0805]
R29  10k  R-EU_M0805  [M0805]
S1  10-XX  [B3F-10XX]
S2  10-XX  [B3F-10XX]
S3  10-XX  [B3F-10XX]
S4  10-XX  [B3F-10XX]
S5  10-XX  [B3F-10XX]

### Nets
+3V3: R11.2 R12.2 R21.2 R22.2 R29.2 ; also sheet 2,3,4,5,7
+5V: C14.1 IC6.3(P:VCC) JP7.2(+5V) JP8.2(+5V) JP9.2(+5V) LED1.1(ARED) LED1.3(AGREEN) LED1.4(ABLUE) LED2.1(ARED) LED2.3(AGREEN) LED2.4(ABLUE) ; also sheet 3,4,5,7
+15V: JP7.1(+15V) JP8.1(+15V) JP9.1(+15V) ; also sheet 4,5,7
BTN1: S1.2(S1) ; also sheet 1
BTN2: S2.2(S1) ; also sheet 1
BTN3: S3.2(S1) ; also sheet 1
BTN4: S4.2(S1) ; also sheet 1
BTN5: S5.2(S1) ; also sheet 1
CANH: JP11.4(B) JP12.4(B) JP13.4(B) R28.2 ; also sheet 2
CANL: JP11.5(A) JP12.5(A) JP13.5(A) R28.1 ; also sheet 2
ENC_A1: C13.1 R20.2 ; also sheet 3
ENC_A2: C9.1 R10.2 ; also sheet 1
ENC_B1: C12.1 R19.2 ; also sheet 3
ENC_B2: C8.1 R9.2 ; also sheet 1
ENC_I1: ENC1.E(Y) R29.1 ; also sheet 3
ENC_I2: ENC2.E(Y) ; also sheet 1
GND: C8.2 C9.2 C12.2 C13.2 C14.2 C15.2 C16.2 ENC1.C ENC1.D(X) ENC2.C ENC2.D(X) IC6.2(P:GND) JP7.3(GND) JP8.3(GND) JP9.3(GND) JP11.3(GND) JP12.3(GND) JP13.3(GND) Q1.2(E) Q2.2(E) Q3.2(E) Q4.2(E) Q5.2(E) Q6.2(E) R1.A R2.A R24.1 S1.3(P) S2.3(P) S3.3(P) S4.3(P) S5.3(P) ; also sheet 2,3,4,5,7
LED_B1: R16.1 ; also sheet 2
LED_B2: R6.1 ; also sheet 3
LED_G1: R17.1 ; also sheet 2
LED_G2: R7.1 ; also sheet 3
LED_R1: R18.1 ; also sheet 2
LED_R2: R8.1 ; also sheet 3
N$13: IC6.6(D:CANL) JP7.5(A) JP8.5(A) JP9.5(A) R23.1
N$14: IC6.7(D:CANH) JP7.4(B) JP8.4(B) JP9.4(B) R23.2
N$15: LED2.6(CRED) R3.2
N$16: Q2.3(C) R4.1
N$17: LED2.5(CBLUE) R5.2
N$18: Q3.1(B) R6.2
N$19: Q2.1(B) R7.2
N$20: Q1.1(B) R8.2
N$21: Q1.3(C) R3.1
N$22: LED2.2(CGREEN) R4.2
N$23: Q3.3(C) R5.1
N$26: ENC2.B R9.1 R11.1
N$27: ENC2.A R10.1 R12.1
N$30: LED1.6(CRED) R13.2
N$31: Q5.3(C) R14.1
N$32: LED1.5(CBLUE) R15.2
N$33: Q6.1(B) R16.2
N$34: Q5.1(B) R17.2
N$35: Q4.1(B) R18.2
N$36: Q4.3(C) R13.1
N$37: LED1.2(CGREEN) R14.2
N$38: Q6.3(C) R15.1
N$40: ENC1.B R19.1 R21.1
N$41: ENC1.A R20.1 R22.1
N$47: JP11.2(+5V) JP12.2(+5V) JP13.2(+5V)
N$48: JP11.1(+15V) JP12.1(+15V) JP13.1(+15V)
N$49: IC6.8(D:RS) R24.2
POT1: C16.1 R1.S ; also sheet 2
POT2: C15.1 R2.S ; also sheet 3
SAB_RXD: IC6.4(D:RXD) ; also sheet 1
SAB_TXD: IC6.1(D:TXD) ; also sheet 1
VREF: R1.E R2.E ; also sheet 3
Unconnected: IC6.5(D:VREF) S1.1(S) S1.4(P1) S2.1(S) S2.4(P1) S3.1(S) S3.4(P1) S4.1(S) S4.4(P1) S5.1(S) S5.4(P1)

### Buses
L1_[1..2],L2_[1..2],L3_[1..2],A[1..5],B[1..5],I[1..5],ENC_A[1..2],ENC_B[1..2],ENC_I[1..2],BTN[1..5]
LED_R[1..2],LED_G[1..2],LED_B[1..2]
IOUT[1..5],VREF,VREF2,POT[1..2]

## Sheet 7 of 7
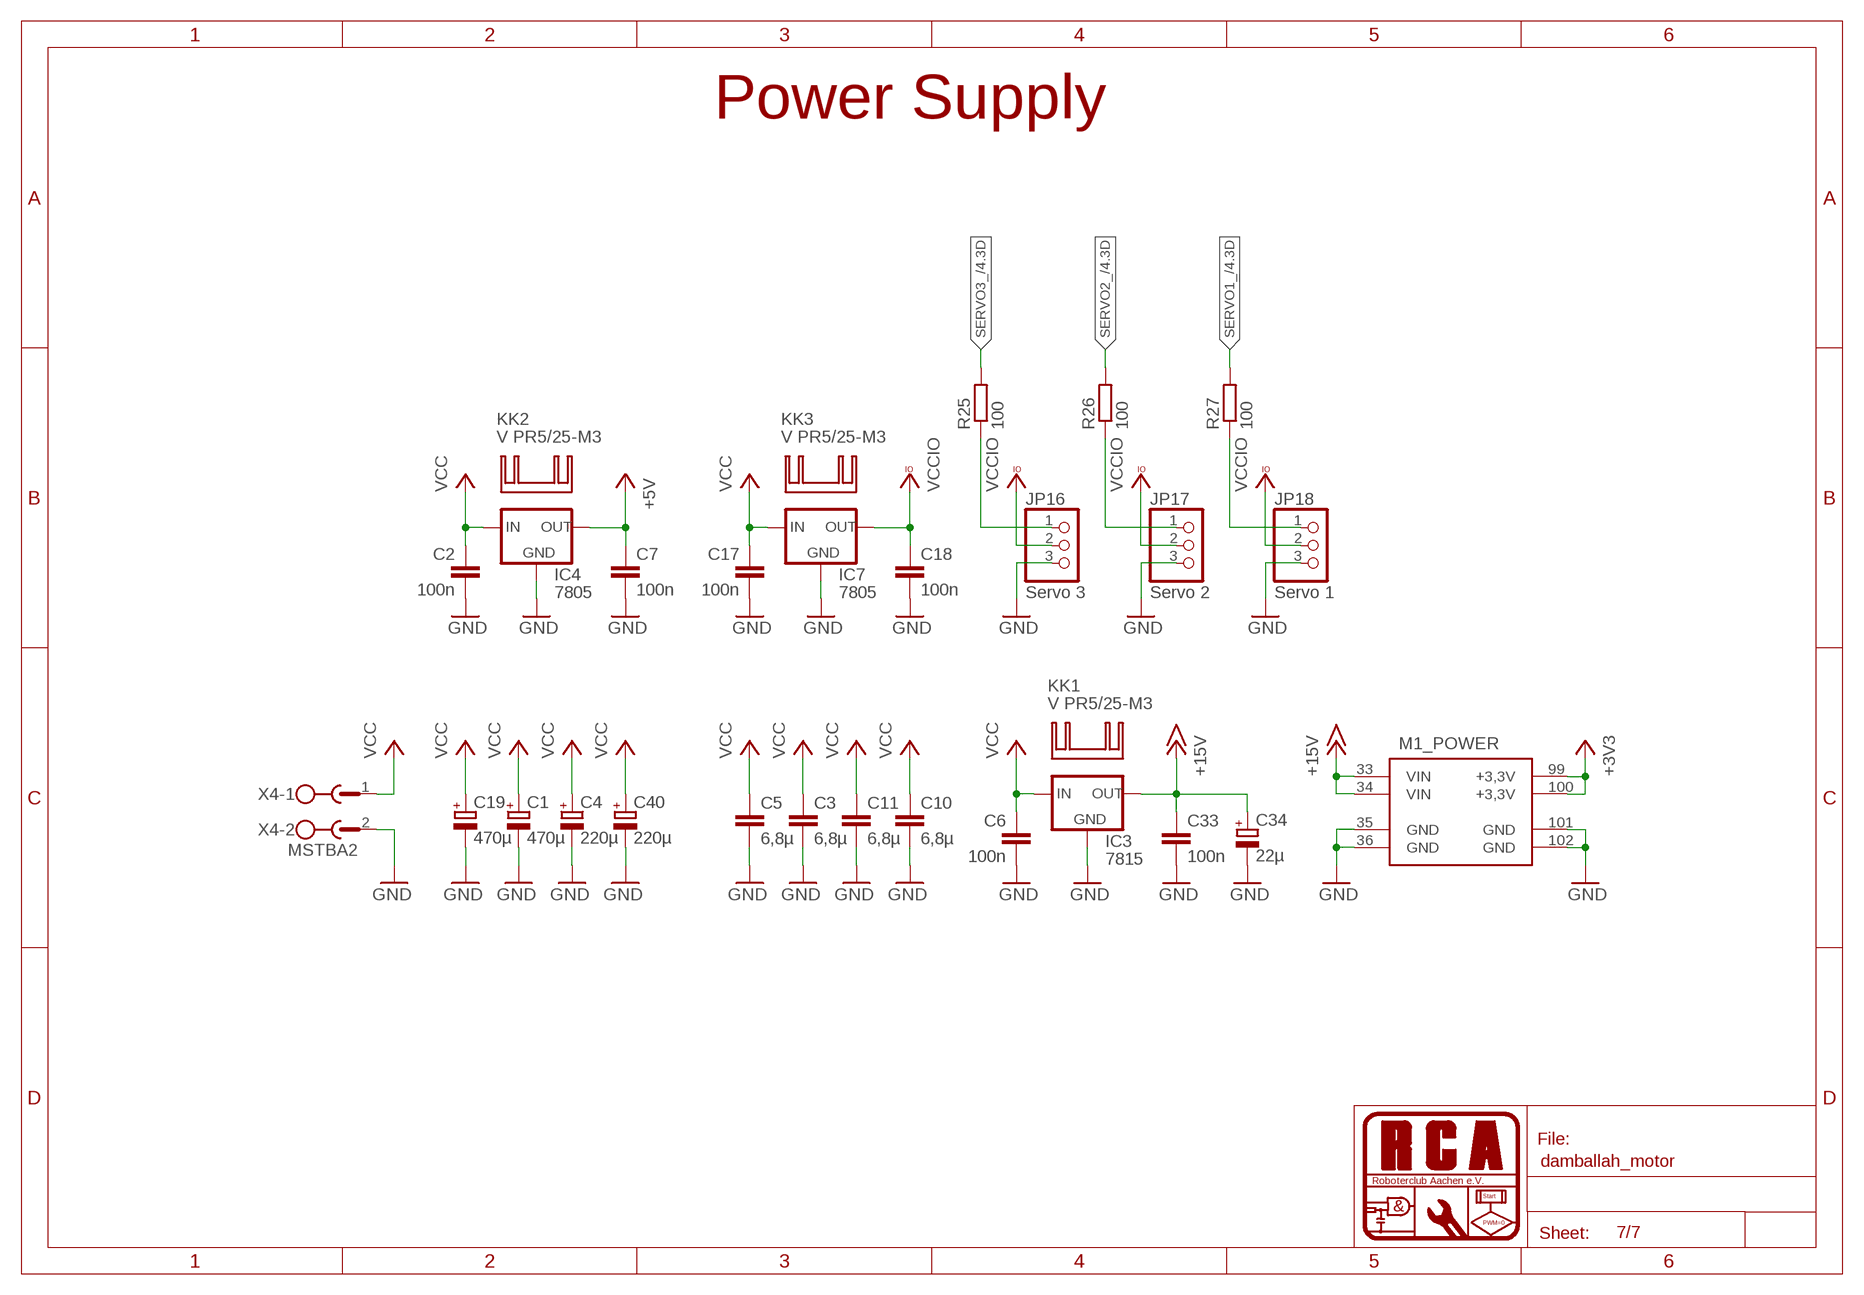
[diagram p6: schematic, sheet 7]

### Parts
C1  470µ  CPOL-EUE5-13  [E5-13]
C2  100n  C-EUC0805  [C0805]
C3  6,8µ  C-EUW  [MKS-2-8572]
C4  220µ  CPOL-EUE5-10.5  [E5-10,5]
C5  6,8µ  C-EUW  [MKS-2-8572]
C6  100n  C-EUC0805  [C0805]
C7  100n  C-EUC0805  [C0805]
C10  6,8µ  C-EUW  [MKS-2-8572]
C11  6,8µ  C-EUW  [MKS-2-8572]
C17  100n  C-EUC0805  [C0805]
C18  100n  C-EUC0805  [C0805]
C19  470µ  CPOL-EUE5-13  [E5-13]
C33  100n  C-EUC0805  [C0805]
C34  22µ  CPOL-EUE2.5-6  [E2,5-6]
C40  220µ  CPOL-EUE5-10.5  [E5-10,5]
IC3  7815  78XXS  [78XXS]
IC4  7805  78XXS  [78XXS]
IC7  7805  78XXS  [78XXS]
JP16  Servo 3  PINHD-1X3  [1X03]
JP17  Servo 2  PINHD-1X3  [1X03]
JP18  Servo 1  PINHD-1X3  [1X03]
KK1  V PR5/25-M3  SK95-2M3  [SK95-2M3]
KK2  V PR5/25-M3  SK95-2M3  [SK95-2M3]
KK3  V PR5/25-M3  SK95-2M3  [SK95-2M3]
R25  100  R-EU_R0805  [R0805]
R26  100  R-EU_R0805  [R0805]
R27  100  R-EU_R0805  [R0805]
X4  MSTBA2  [MSTBA2]

### Nets
+3V3: M1.99(_POWER:+3,3V) M1.100(_POWER:+3,3V) ; also sheet 2,3,4,5,6
+5V: C7.1 IC4.OUT ; also sheet 3,4,5,6
+15V: C33.1 C34.+ IC3.OUT M1.33(_POWER:VIN) M1.34(_POWER:VIN) ; also sheet 4,5,6
GND: C1.- C2.2 C3.2 C4.- C5.2 C6.2 C7.2 C10.2 C11.2 C17.2 C18.2 C19.- C33.2 C34.- C40.- IC3.GND IC4.GND IC7.GND JP16.3 JP17.3 JP18.3 M1.35(_POWER:GND) M1.36(_POWER:GND) M1.101(_POWER:GND) M1.102(_POWER:GND) X4.2 ; also sheet 2,3,4,5,6
N$24: JP16.1 R25.1
N$25: JP17.1 R26.1
N$28: JP18.1 R27.1
SERVO1_: R27.2 ; also sheet 4
SERVO2_: R26.2 ; also sheet 4
SERVO3_: R25.2 ; also sheet 4
VCC: C1.+ C2.1 C3.1 C4.+ C5.1 C6.1 C10.1 C11.1 C17.1 C19.+ C40.+ IC3.IN IC4.IN IC7.IN X4.1 ; also sheet 4,5
VCCIO: C18.1 IC7.OUT JP16.2 JP17.2 JP18.2

### Notes on the sheet
- Power Supply

## Library data of the parts
C1 C4 C19 C34 C40 = rcl:CPOL-EU: POLARIZED CAPACITOR, European symbol
C2 C6-C9 C12-C18 C20 C33 = rcl:C-EU: CAPACITOR, European symbol
C3 C5 C10 C11 = rca_sontiges:C-EU: MKS-2 Kondensatoren Metallisiert Polyester-Kondensatoren im Rastermaß 5mm "MKS-2 $(WERT)" bei Reichelt 6,8µ/50V braucht das breitere Gehäuse (W: 8,5x7,2mm)
ENC1 ENC2 = rca_sontiges:ENCODER: Drehimpulsgeber ALPS STEC12E Drehimpulsg., 24/24, vert., MT Reichelt: STEC12E08 (1,90?, Stand 10.11.2011) Inkremental Drehgeber in Printmontage. In Snap-In Ausführung. Impulse: 24 Rastungen: 24 Einbau: vertikal Metallschaft (ØxL): 6 x 20 mm, abgeflacht Schaltweg: 0,5 mm Isolationswiderstand: 10 MOhm/ 50 VDC Encoder Nennspannung: 5 VDC Nennstrom: 0,5 mA Taster Nennspannung: 5 VDC Nennstrom: 1 mA
IC1 IC2 IC12 = 74xx-eu:74*245: Octal BUS TRANSCEIVER, 3-state
IC3 IC4 IC7 = v-reg:78XXS: VOLTAGE REGULATOR
IC5 = linear:LM358: OP AMP also LM158; LM258; LM2904 Source: http://cache.national.com/ds/LM/LM158.pdf
IC6 = rca_ic:MCP2551: High-Speed CAN Transceiver
IC8-IC11 = rca_ic:4050: Hex non-inverting BUFFER
JP1-JP5 JP10 JP14 = rca_stecker:ENCODER: Encoder Stecker siehe ENCODER_DUAL
JP6 JP15 = rca_stecker:SERIAL-DEBUG: Serieller Debugging Stecker Die RXD und TXD Leitungen sollten 5V Pegel haben
JP7-JP9 JP11-JP13 = rca_stecker:SAB: Sensor Actor Bus Connector see xpcc::sab::Master and xpcc::sab::Slave at http://xpcc.sf.net/api
JP16-JP18 = pinhead:PINHD-1X3: PIN HEADER
KK1-KK3 = heatsink:SK95-2M3: HEATSINK manufacturer Fischer/distributor Buerklin
LED1 LED2 = rca_opto:RGB-LED-6: RGB LED with 6 Pins Bei Reichelt: LRTB G6TG (für 0,99?, Stand 9.11.2011)
M1 = loa:DAMBALLAH
M2-M4 = rca11_modules:H-BRIDGE2
M5 M6 = rca12_modules:BRUSHLESS_DRIVER
Q1-Q6 = transistor-npn:BC847*: NPN Transistor
R1 R2 = pot:TRIM_EU-: POTENTIOMETER
R3-R32 = rcl:R-EU_: RESISTOR, European symbol
RN1-RN8 = resistor-dil:4R-N: Array Chip Resistor Source: RS Component / Phycomp
S1-S5 = switch-omron:10-XX: OMRON SWITCH
SV1 = con-lstb:MA05-2: PIN HEADER
SV2 SV6 = con-lstb:MA06-2: PIN HEADER
SV3 = con-lstb:MA03-2: PIN HEADER
X1-X4 = con-phoenix-508:MSTBA2: PHOENIX
X5 X6 = con-phoenix-508:MSTBA3: PHOENIX